# Altium schematic sheet 0_ADSTM32-Overview.SchDoc
size A4; SheetNumber: 1; SheetTotal: 4
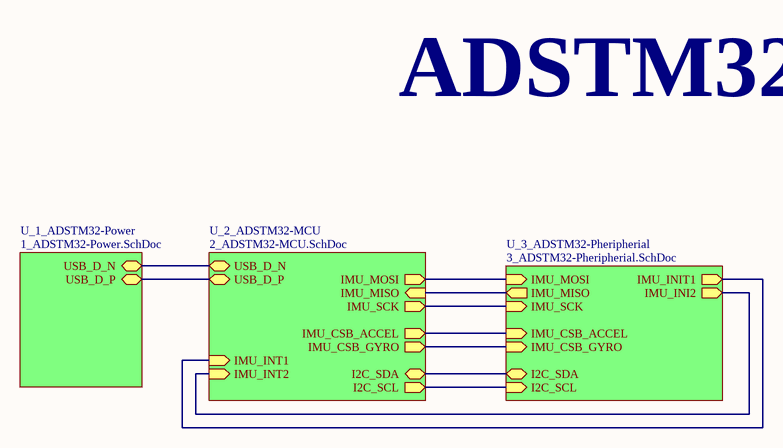
[diagram p0: 0_ADSTM32-Overview.SchDoc]

## Sub-sheets
U_1_ADSTM32-Power = 1_ADSTM32-Power.SchDoc: USB_D_N (bidir), USB_D_P (bidir)
U_2_ADSTM32-MCU = 2_ADSTM32-MCU.SchDoc: USB_D_N (bidir), USB_D_P (bidir), IMU_SCK (out), IMU_MISO (in), IMU_MOSI (out), IMU_CSB_ACCEL (out), IMU_CSB_GYRO (out), I2C_SCL (out), I2C_SDA (bidir), IMU_INT1 (in), IMU_INT2 (in)
U_3_ADSTM32-Pheripherial = 3_ADSTM32-Pheripherial.SchDoc: IMU_SCK (in), IMU_MISO (out), IMU_MOSI (in), IMU_CSB_ACCEL (in), IMU_CSB_GYRO (in), IMU_INIT1 (out), IMU_INI2 (out), I2C_SCL (in), I2C_SDA (bidir)

## Nets
(unnamed): sheet U_1_ADSTM32-Power/USB_D_N, sheet U_2_ADSTM32-MCU/USB_D_N
(unnamed): sheet U_1_ADSTM32-Power/USB_D_P, sheet U_2_ADSTM32-MCU/USB_D_P
(unnamed): sheet U_2_ADSTM32-MCU/IMU_SCK, sheet U_3_ADSTM32-Pheripherial/IMU_SCK
(unnamed): sheet U_2_ADSTM32-MCU/IMU_MISO, sheet U_3_ADSTM32-Pheripherial/IMU_MISO
(unnamed): sheet U_2_ADSTM32-MCU/IMU_MOSI, sheet U_3_ADSTM32-Pheripherial/IMU_MOSI
(unnamed): sheet U_2_ADSTM32-MCU/IMU_CSB_ACCEL, sheet U_3_ADSTM32-Pheripherial/IMU_CSB_ACCEL
(unnamed): sheet U_2_ADSTM32-MCU/IMU_CSB_GYRO, sheet U_3_ADSTM32-Pheripherial/IMU_CSB_GYRO
(unnamed): sheet U_2_ADSTM32-MCU/I2C_SCL, sheet U_3_ADSTM32-Pheripherial/I2C_SCL
(unnamed): sheet U_2_ADSTM32-MCU/I2C_SDA, sheet U_3_ADSTM32-Pheripherial/I2C_SDA
(unnamed): sheet U_2_ADSTM32-MCU/IMU_INT1, sheet U_3_ADSTM32-Pheripherial/IMU_INIT1
(unnamed): sheet U_2_ADSTM32-MCU/IMU_INT2, sheet U_3_ADSTM32-Pheripherial/IMU_INI2

## Notes on the sheet
- ADSTM32